# Altium project Hub.PrjPcb
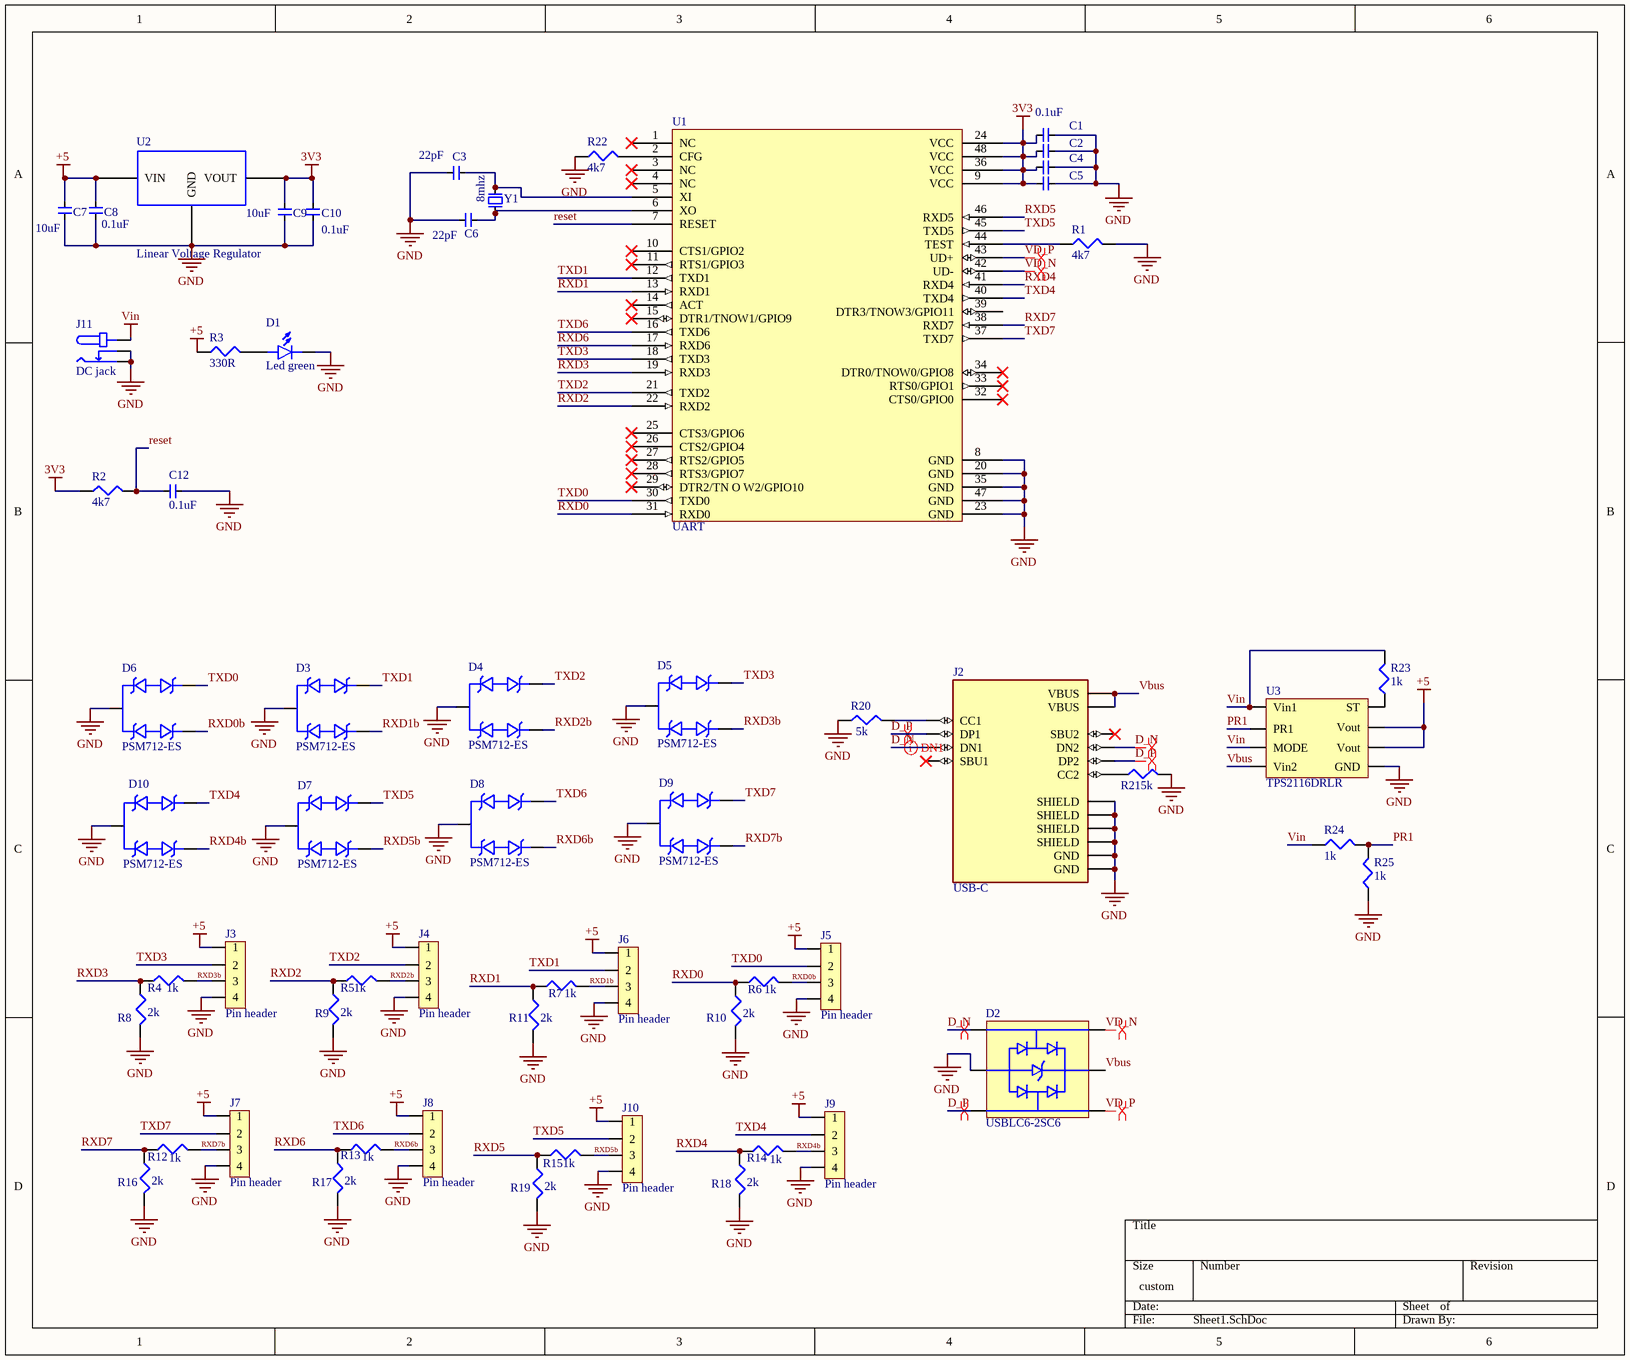
[diagram p0: Sheet1.SchDoc]
1 sheet, 60 parts. Net scope: global (net labels, ports and power ports of the same name join across sheets).
Board file: PCB2.PcbDoc

## Sheet Sheet1.SchDoc
size 304 x 254 mm; SheetNumber: 1; SheetTotal: 1

### Parts
C1  0.1uF  [0603 cap]
C2  100nF capacitor  [0603 cap]  (value not drawn)
C3  22pF  [0603 cap]
C4  100nF capacitor  [0603 cap]  (value not drawn)
C5  100nF capacitor  [0603 cap]  (value not drawn)
C6  22pF  [0603 cap]
C7  10uF  [0603 cap]
C8  0.1uF  [0603 cap]
C9  10uF  [0603 cap]
C10  0.1uF  [0603 cap]
C12  0.1uF  [0603 cap]
D1  Led green  [0805led]
D2  USBLC6-2SC6  [SOP23-6l]
D3  PSM712-ES  [sop23]
D4  PSM712-ES  [sop23]
D5  PSM712-ES  [sop23]
D6  PSM712-ES  [sop23]
D7  PSM712-ES  [sop23]
D8  PSM712-ES  [sop23]
D9  PSM712-ES  [sop23]
D10  PSM712-ES  [sop23]
J2  USB-C  [USB-C]
J3  Pin header  [jst 4 pin]
J4  Pin header  [jst 4 pin]
J5  Pin header  [jst 4 pin]
J6  Pin header  [jst 4 pin]
J7  Pin header  [jst 4 pin]
J8  Pin header  [jst 4 pin]
J9  Pin header  [jst 4 pin]
J10  Pin header  [jst 4 pin]
J11  DC jack  [DC jack]
R1  4k7  [0603 cap]
R2  4k7  [0603 cap]
R3  330R  [0603 cap]
R4  1k  [0603 cap]
R5  1k  [0603 cap]
R6  1k  [0603 cap]
R7  1k  [0603 cap]
R8  2k  [0603 cap]
R9  2k  [0603 cap]
R10  2k  [0603 cap]
R11  2k  [0603 cap]
R12  1k  [0603 cap]
R13  1k  [0603 cap]
R14  1k  [0603 cap]
R15  1k  [0603 cap]
R16  2k  [0603 cap]
R17  2k  [0603 cap]
R18  2k  [0603 cap]
R19  2k  [0603 cap]
R20  5k  [0603 cap]
R21  5k  [0603 cap]
R22  4k7  [0603 cap]
R23  1k  [0603 cap]
R24  1k  [0603 cap]
R25  1k  [0603 cap]
U1  UART  [UART]
U2  Linear Voltage Regulator  [linear voltage regulato]
U3  TPS2116DRLR  [SOP8]
Y1  8mhz  [crystal]

### Nets
3V3: C1.1 C2.1 C4.1 C5.1 C9.2 C10.2 R2.1 U1.9(VCC) U1.24(VCC) U1.36(VCC) U1.48(VCC) U2.2(VOUT)
+5: C7.2 C8.2 J3.1 J4.1 J5.1 J6.1 J7.1 J8.1 J9.1 J10.1 R3.1 U2.3(VIN) U3.2(Vout) U3.7(Vout)
GND: C1.2 C2.2 C3.1 C4.2 C5.2 C6.1 C7.1 C8.1 C9.1 C10.1 C12.1 D1.2 D2.2(GND) D3.3 D4.3 D5.3 D6.3 D7.3 D8.3 D9.3 D10.3 J2.A1/B12(GND) J2.B1/A12(GND) J2.S1(SHIELD) J2.S2(SHIELD) J2.S3(SHIELD) J2.S4(SHIELD) J3.4 J4.4 J5.4 J6.4 J7.4 J8.4 J9.4 J10.4 J11.1 J11.3 R1.2 R8.2 R9.2 R10.2 R11.2 R16.2 R17.2 R18.2 R19.2 R20.1 R21.2 R22.1 R25.1 U1.8(GND) U1.20(GND) U1.23(GND) U1.35(GND) U1.47(GND) U2.1(GND) U3.1(GND)
Vin: J11.2 R23.2 R24.1 U3.3(Vin1) U3.5(MODE)
D_N: D2.1(I/O_1) J2.A7(DN1) J2.B7(DN2)
D_P: D2.3(I/O_2) J2.A6(DP1) J2.B6(DP2)
PR1: R24.2 R25.2 U3.4(PR1)
reset: C12.2 R2.2 U1.7(RESET)
RXD0: R6.1 R10.1 U1.31(RXD0)
RXD0b: D6.1 J5.3 R6.2
RXD1: R7.1 R11.1 U1.13(RXD1)
RXD1b: D3.1 J6.3 R7.2
RXD2: R5.1 R9.1 U1.22(RXD2)
RXD2b: D4.1 J4.3 R5.2
RXD3: R4.1 R8.1 U1.19(RXD3)
RXD3b: D5.1 J3.3 R4.2
RXD4: R14.1 R18.1 U1.41(RXD4)
RXD4b: D10.1 J9.3 R14.2
RXD5: R15.1 R19.1 U1.46(RXD5)
RXD5b: D7.1 J10.3 R15.2
RXD6: R13.1 R17.1 U1.17(RXD6)
RXD6b: D8.1 J8.3 R13.2
RXD7: R12.1 R16.1 U1.38(RXD7)
RXD7b: D9.1 J7.3 R12.2
TXD0: D6.2 J5.2 U1.30(TXD0)
TXD1: D3.2 J6.2 U1.12(TXD1)
TXD2: D4.2 J4.2 U1.21(TXD2)
TXD3: D5.2 J3.2 U1.18(TXD3)
TXD4: D10.2 J9.2 U1.40(TXD4)
TXD5: D7.2 J10.2 U1.45(TXD5)
TXD6: D8.2 J8.2 U1.16(TXD6)
TXD7: D9.2 J7.2 U1.37(TXD7)
Vbus: D2.5(Vbus) J2.A4/B9(VBUS) J2.B4/A9(VBUS) U3.6(Vin2)
VD_N: D2.6(I/O_1) U1.42(UD-)
VD_P: D2.4(I/O_2) U1.43(UD+)
NetC3_2: C3.2 U1.5(XI) Y1.2
NetC6_2: C6.2 U1.6(XO) Y1.1
NetD1_1: D1.1 R3.2
NetJ2_A5: J2.A5(CC1) R20.2
NetJ2_B5: J2.B5(CC2) R21.1
NetR1_1: R1.1 U1.44(TEST)
NetR22_2: R22.2 U1.2(CFG)
NetR23_1: R23.1 U3.8(ST)

Not connected (* = marked no-connect by the designer): J2 A8(SBU1)* B8(SBU2)*; U1 1(NC)* 3(NC)* 4(NC)* 10(CTS1/GPIO2)* 11(RTS1/GPIO3)* 14(ACT)* 15(DTR1/TNOW1/GPIO9)* 25(CTS3/GPIO6_)* 26(CTS2/GPIO4)* 27(RTS2/GPIO5)* 28(RTS3/GPIO7)* 29(DTR2/TN_O_W2/GPIO10)* 32(CTS0/GPIO0)* 33(RTS0/GPIO1)* 34(DTR0/TNOW0/GPIO8)* 39(DTR3/TNOW3/GPIO11)

### Layout directives
differential pair: D_N, D_P, VD_N, VD_P

### Library data of the parts
C1 C2 C4 C5 C8 C10 C12 = 100nF capacitor: 50V 100nF X7R ±10% 0603 Multilayer Ceramic Capacitors MLCC - SMD/SMT ROHS; Manufacturer: PSA(Prosperity Dielectrics); Mfr. Part #: FN18X104K500PBG; supplier: LCSC; LCSC Part #: C235731
C3 C6 = 22pF capacitor: 50V 22pF C0G ±5% 0603 Multilayer Ceramic Capacitors MLCC - SMD/SMT ROHS; Manufacturer: PSA(Prosperity Dielectrics); Mfr. Part #: FN18N220J500PSG; supplier: LCSC; LCSC Part #: C525244
C7 C9 = 10uF capacitor: 6.3V 10uF ±10% 0603 Multilayer Ceramic Capacitors MLCC - SMD/SMT ROHS; Manufacturer: PSA(Prosperity Dielectrics); Mfr. Part #: FS18B106K6R3PBG; supplier: LCSC; LCSC Part #: C2836875
D1 = Led green: Emerald 0805 Light Emitting Diodes (LED) ROHS; Manufacturer: Yongyu Photoelectric; Mfr. Part #: SZYY0805G; supplier: LCSC; LCSC Part #: C434432
D2 = USBLC6-2SC6: 5A 17V 6V Unidirectional 5.25V SOT-23-6 Electrostatic and Surge Protection (TVS/ESD) ROHS; Manufacturer: STMicroelectronics; Mfr. Part #: USBLC6-2SC6; supplier: LCSC; LCSC Part #: C7519
D3-D10 = PSM712-ES: 17A 350W Bi-Directional SOT-23 Electrostatic and Surge Protection (TVS/ESD) ROHS; Manufacturer: ElecSuper; Mfr. Part #: PSM712-ES; Supplier: LCSC; LCSC Part #: C5180294
J2 = USB-C: 5A 1 16P Female Type-C SMD USB Connectors ROHS; Manufacturer: Korean Hroparts Elec; Mfr. Part #: TYPE-C-31-M-12; supplier: LCSC; LCSC Part #: C165948
J3-J10 = Pin header: 1x4P 4P XH 1 2.5mm 4 Phosphor bronze Plugin,P=2.5mm Wire To Board Connector ROHS; Manufacturer: BOOMELE; Mfr. Part #: XH-4A; Supplier: LCSC; LCSC Part #: C37815
J11 = DC jack: Panel Mounting DC Power Receptacle 260℃ Brass -20℃~+70℃ 2mm 6.2mm 2.5A 24V Plugin DC Power Connector ROHS; Manufacturer: XKB Connection; Mfr. Part #: DC-005-2.5A-2.0; Supplier: LCSC; LCSC Part #: C319099
R1 R2 R22 = 4k7 resistor: 100mW Thick Film Resistors 75V ±100ppm/℃ ±5% 4.7kΩ 0603 Chip Resistor - Surface Mount ROHS; Manufacturer: UNI-ROYAL(Uniroyal Elec); Mfr. Part #: 0603WAJ0472T5E; supplier: LCSC; LCSC Part #: C25999
R3 = 330R: 100mW Thick Film Resistors 75V ±100ppm/℃ ±1% 330Ω 0603 Chip Resistor - Surface Mount ROHS; Manufacturer: UNI-ROYAL(Uniroyal Elec); Mfr. Part #: 0603WAF3300T5E; supplier: LCSC; LCSC Part #: C23138
R4-R7 R12-R15 R23-R25 = 1k resistor: 100mW Thick Film Resistors 75V ±100ppm/℃ ±1% 1kΩ 0603 Chip Resistor - Surface Mount ROHS; Manufacturer: UNI-ROYAL(Uniroyal Elec); Mfr. Part #: 0603WAF1001T5E; supplier: LCSC; LCSC Part #: C21190
R8-R11 R16-R19 = 2k resistor: 100mW Thick Film Resistors 75V ±100ppm/℃ ±1% 2kΩ 0603 Chip Resistor - Surface Mount ROHS; Manufacturer: UNI-ROYAL(Uniroyal Elec); Mfr. Part #: 0603WAF2001T5E; supplier: LCSC; LCSC Part #: C22975
R20 R21 = 5k: 100mW Thick Film Resistors 75V ±100ppm/℃ ±1% 330Ω 0603 Chip Resistor - Surface Mount ROHS; Manufacturer: UNI-ROYAL(Uniroyal Elec); Mfr. Part #: 0603WAF5101T5E; supplier: LCSC; LCSC Part #: C23186
U1 = UART: LQFP-48(7x7) USB ICs ROHS; Manufacturer: WCH(Jiangsu Qin Heng); Manufacturer Part Number: CH348Q; Supplier: LCSC; Supplier Part Number: C2979161
U2 = Linear Voltage Regulator: SOT-223 Linear Voltage Regulators (LDO) ROHS; Manufacturer: IDCHIP; Manufacturer part number: 1117-5; Supplier: LCSC; Supplier part number: C5125089
U3 = TPS2116DRLR: 1.6V~5.5V 42mΩ 2.5A 1 SOT-583 Power Distribution Switches ROHS; Manufacturer: Texas Instruments; Mfr. Part #: TPS2116DRLR; supplier: LCSC; LCSC Part #: C3235557
Y1 = Crystal 8mhz: 8MHz 贴片晶振 20pF ±20ppm ±20ppm HC-49S-SMD Crystals ROHS; Manufacturer: KYX; Mfr. Part #: KBD080002020; supplier: LCSC; LCSC Part #: C2835983